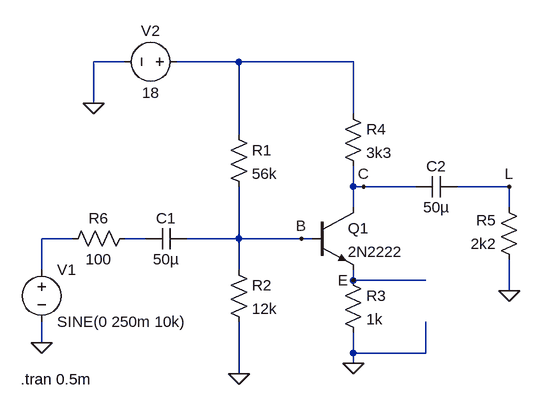
[diagram p0: schematic Ej#11.asc]
Ej#11.asc, the LTspice schematic file:
Version 4
SHEET 1 880 680
WIRE -272 -112 -320 -112
WIRE -96 -112 -192 -112
WIRE 80 -112 -96 -112
WIRE -320 -48 -320 -112
WIRE 80 -32 80 -112
WIRE -96 0 -96 -112
WIRE 80 80 80 48
WIRE 96 80 80 80
WIRE 176 80 96 80
WIRE 320 80 240 80
WIRE 80 112 80 80
WIRE 320 112 320 80
WIRE -352 160 -400 160
WIRE -240 160 -272 160
WIRE -96 160 -96 80
WIRE -96 160 -176 160
WIRE 0 160 -96 160
WIRE 16 160 0 160
WIRE -400 208 -400 160
WIRE -96 208 -96 160
WIRE 80 224 80 208
WIRE 192 224 80 224
WIRE 320 240 320 192
WIRE -400 320 -400 288
WIRE 80 336 80 304
WIRE 192 336 192 288
WIRE 192 336 80 336
WIRE 80 352 80 336
WIRE -96 368 -96 288
FLAG 80 352 0
FLAG -96 368 0
FLAG 320 240 0
FLAG -400 320 0
FLAG -320 -48 0
FLAG 0 160 B
FLAG 96 80 C
FLAG 80 224 E
FLAG 320 80 L
SYMBOL res -112 -16 R0
SYMATTR InstName R1
SYMATTR Value 56k
SYMBOL res -112 192 R0
SYMATTR InstName R2
SYMATTR Value 12k
SYMBOL res 64 208 R0
SYMATTR InstName R3
SYMATTR Value 1k
SYMBOL res 64 -48 R0
SYMATTR InstName R4
SYMATTR Value 3k3
SYMBOL res 336 208 R180
WINDOW 0 36 76 Left 2
WINDOW 3 36 40 Left 2
SYMATTR InstName R5
SYMATTR Value 2k2
SYMBOL res -256 144 R90
WINDOW 0 0 56 VBottom 2
WINDOW 3 32 56 VTop 2
SYMATTR InstName R6
SYMATTR Value 100
SYMBOL cap 240 64 R90
WINDOW 0 0 32 VBottom 2
WINDOW 3 32 32 VTop 2
SYMATTR InstName C2
SYMATTR Value 50µ
SYMBOL voltage -400 192 R0
WINDOW 123 0 0 Left 0
WINDOW 39 0 0 Left 0
SYMATTR InstName V1
SYMATTR Value SINE(0 250m 10k)
SYMBOL voltage -176 -112 R90
WINDOW 0 -32 56 VBottom 2
WINDOW 3 32 56 VTop 2
WINDOW 123 0 0 Left 0
WINDOW 39 0 0 Left 0
SYMATTR InstName V2
SYMATTR Value 18
SYMBOL npn 16 112 R0
SYMATTR InstName Q1
SYMATTR Value 2N2222
SYMBOL cap -176 144 R90
WINDOW 0 0 32 VBottom 2
WINDOW 3 32 32 VTop 2
SYMATTR InstName C1
SYMATTR Value 50µ
TEXT -432 376 Left 2 !.tran 0.5m

The netlist it stands for:
* Ej#11.asc
R1 N001 B 56k
R2 B 0 12k
R3 E 0 1k
R4 N001 C 3k3
R5 0 L 2k2
R6 N003 N002 100
C2 L C 50µ
V1 N002 0 SINE(0 250m 10k)
V2 N001 0 18
Q1 C B E 0 2N2222
C1 B N003 50µ
.model NPN NPN
.model PNP PNP
.lib standard.bjt
.tran 0.5m
.backanno
.end